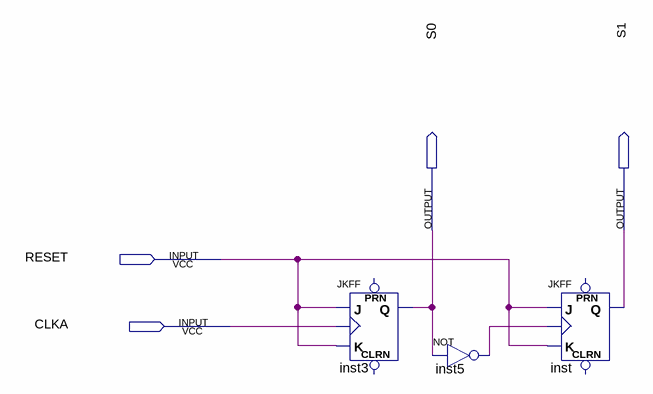
[diagram p0: schematic sheet]
// Quartus schematic Cont2Bits.bdf as structural Verilog: 3 symbols, 4 pins
module Cont2Bits (
  input  RESET,
  input  CLKA,
  output S0,
  output S1
);

  wire inst5_out;

  JKFF inst3 (.K(RESET), .J(RESET), .CLK(CLKA), .Q(S0));  // open: PRN, CLRN
  not inst5 (inst5_out, S0);
  JKFF inst (.K(RESET), .J(RESET), .CLK(inst5_out), .Q(S1));  // open: PRN, CLRN
endmodule
